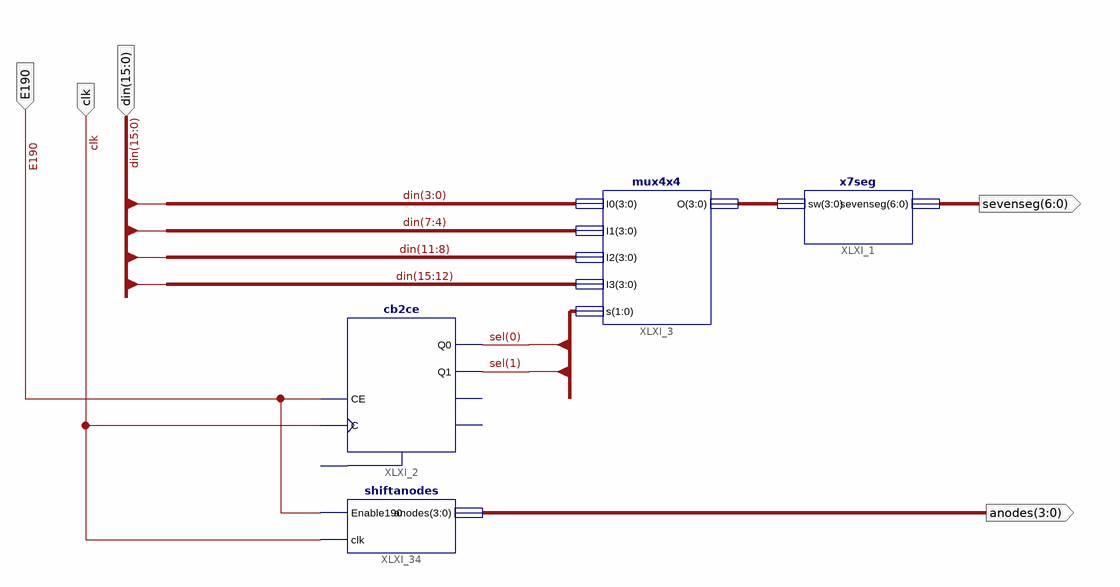
[diagram p0: schematic sheet 1]
// Xilinx ISE schematic afficheur.sch (spartan6) as structural Verilog: 4 symbols, 5 ports
module afficheur (
  input  [15:0] din,
  input  clk,
  input  E190,
  output [6:0] sevenseg,
  output [3:0] anodes
);

  wire [1:0] sel;
  wire [3:0] XLXN_2;

  x7seg XLXI_1 (.sw(XLXN_2), .sevenseg(sevenseg));
  cb2ce XLXI_2 (.C(clk), .CE(E190), .Q0(sel[0]), .Q1(sel[1]));  // open: CLR, CEO, TC
  mux4x4 XLXI_3 (.I0(din[3:0]), .I1(din[7:4]), .I2(din[11:8]), .I3(din[15:12]), .s(sel), .O(XLXN_2));
  shiftanodes XLXI_34 (.Enable190(E190), .clk(clk), .anodes(anodes));
endmodule
